# Altium schematic sheet shield.SchDoc
size B; PageSetup: Record=PageOptions|CenterHorizontal=True|CenterVertical=True|PrintScale=0.72|XCorrection=1.00|YCorrection=1.00|PrintKind=0|BorderSize=5000000|LeftOffset=0|BottomOffset=0|Orientation=2|PaperLength=1000|PaperWidth=1000|Scale=100|PaperSource=7|PrintQuality=-3|MediaType=1|DitherType=10|PrintScaleMode=1|PaperKind=Letter|PaperIndex=1
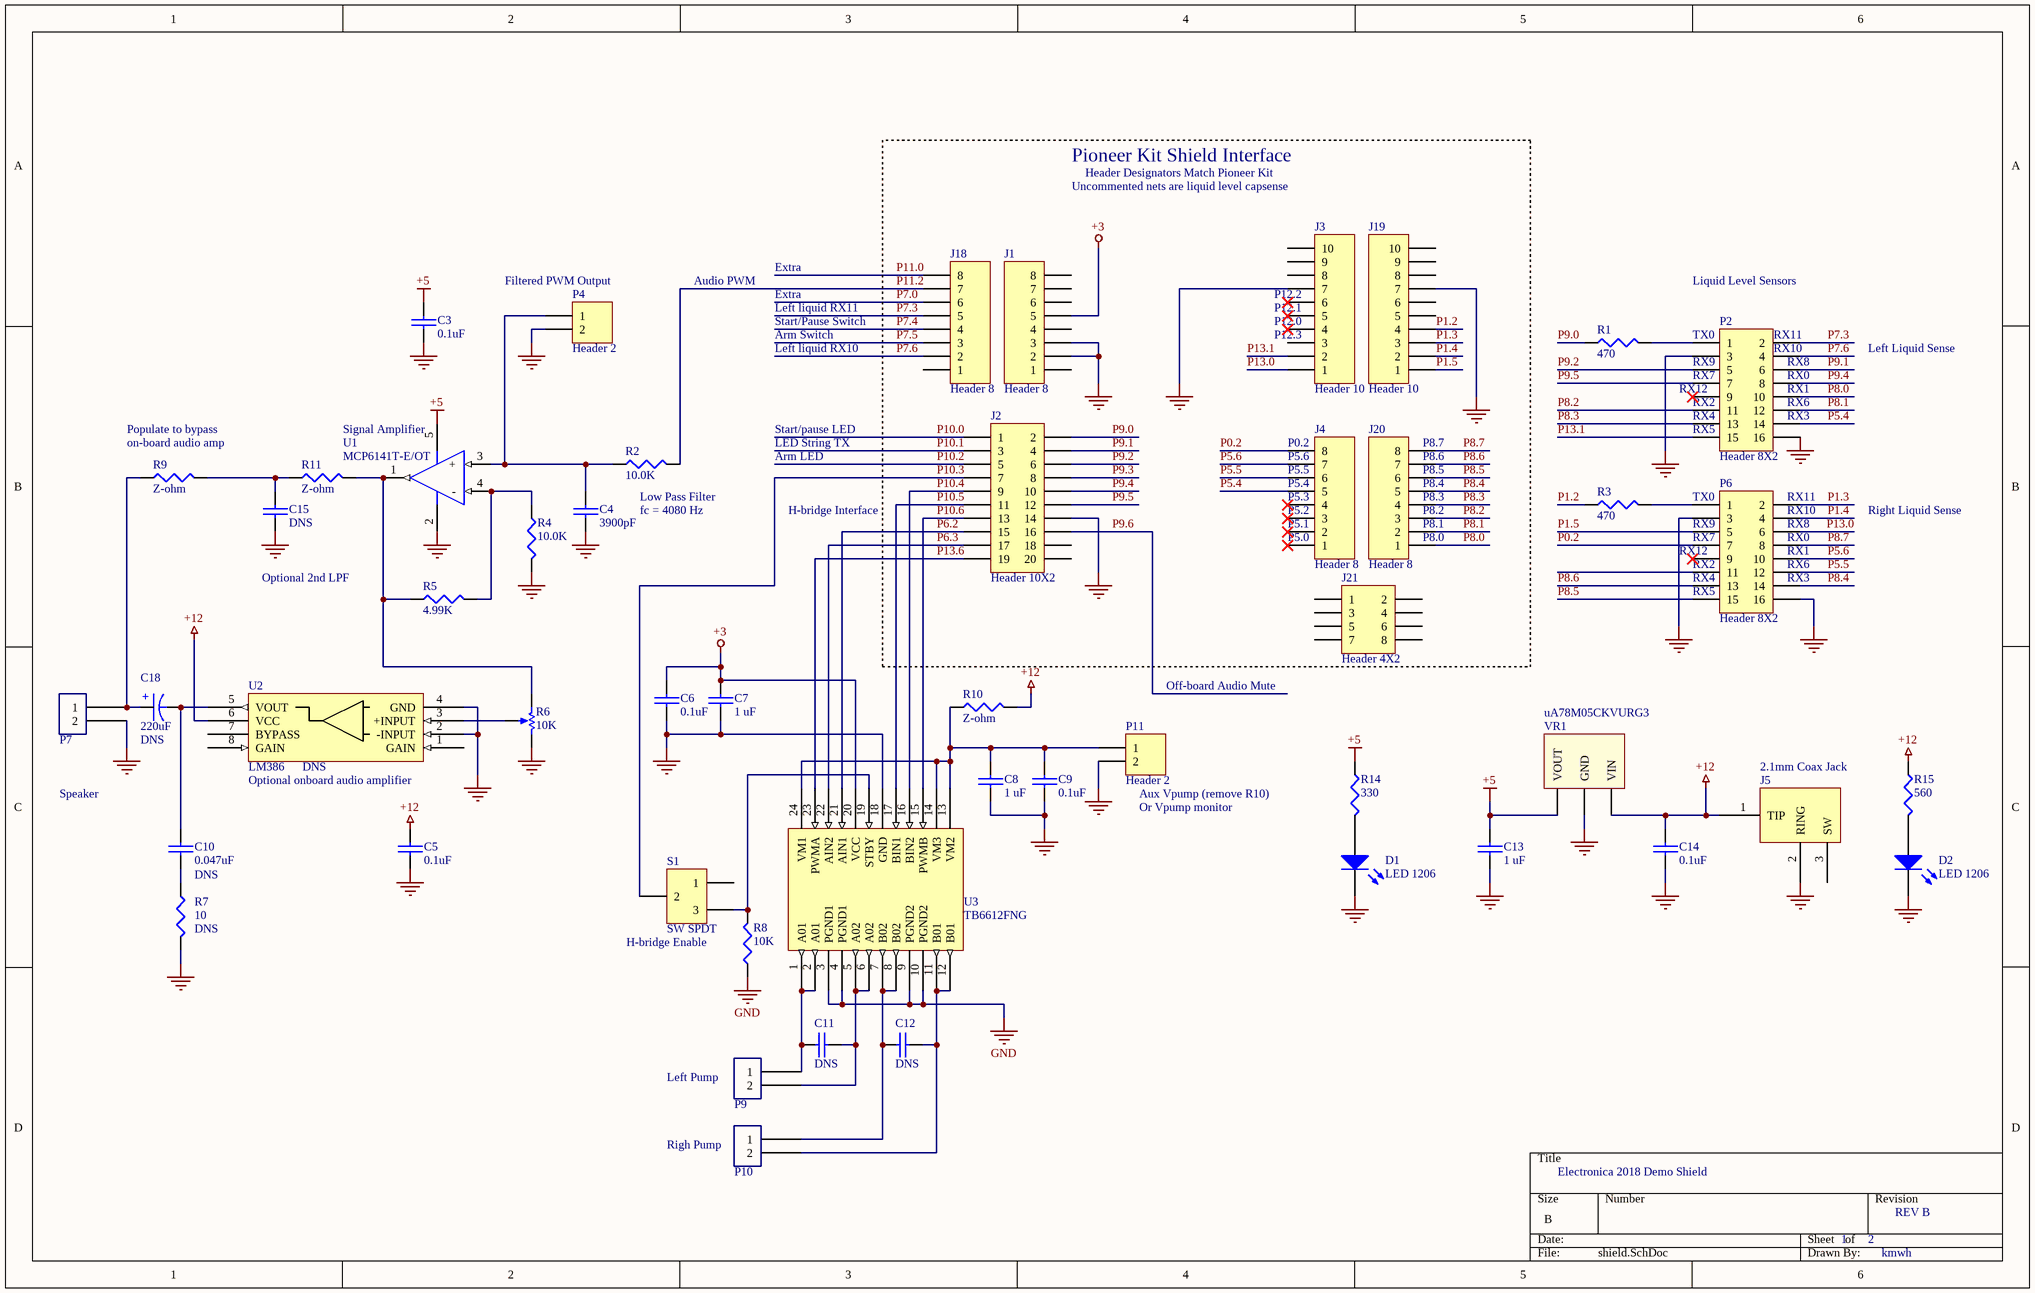
[diagram p0: shield.SchDoc]

## Parts
C3  0.1uF  [C0603]
C4  3900pF  [C0603]
C5  0.1uF  [C0603]
C6  0.1uF  [C0603]
C7  1 uF  [C0805]
C8  1 uF  [C0805]
C9  0.1uF  [C0603]
C10  0.047uF  [C0603]
C11  DNS  [C0805]
C12  DNS  [C0805]
C13  1 uF  [C0805]
C14  0.1uF  [C0603]
C15  DNS  [C0603]
C18  value 220uF  [RadCap.98]  (hidden comment: 11-000010-ARD)
D1  LED 1206  [3216[1206]]
D2  LED 1206  [3216[1206]]
J1  Header 8  [HDR1X8]
J2  Header 10X2  [HDR2X10]
J3  Header 10  [HDR1X10]
J4  Header 8  [HDR1X8]
J5  2.1mm Coax Jack  [COAX_JACK_ALL]
J18  Header 8  [HDR1X8]
J19  Header 10  [HDR1X10]
J20  Header 8  [HDR1X8]
J21  Header 4X2  [HDR2X4]
P2  Header 8X2  [HDR2X8]
P4  Header 2  [HDR1X2]
P6  Header 8X2  [HDR2X8]
P7  Connector, 0.138", 2  [connector-0.138-2pin]  (value not drawn)
P9  Connector, 0.138", 2  [connector-0.138-2pin]  (value not drawn)
P10  Connector, 0.138", 2  [connector-0.138-2pin]  (value not drawn)
P11  Header 2  [HDR1X2]
R1  470  [R0603]
R2  10.0K  [R0603]
R3  470  [R0603]
R4  10.0K  [R0603]
R5  4.99K  [R0603]
R6  value 10K  [TrimmerPot]  (hidden comment: RPot)
R7  10  [R0603]
R8  10K  [R0603]
R9  Z-ohm  [R0603]
R10  Z-ohm  [R0603]
R11  Z-ohm  [R0603]
R14  330  [R0603]
R15  560  [R0603]
S1  SW SPDT  [HDR1X3]
U1  MCP6141T-E/OT  [SOT23-5]
U2  LM386  [SO8]
U3  TB6612FNG  [SSOP-24]
VR1  uA78M05CKVURG3  [TO-252-AB(Dpak)]

## Blocks framed on the sheet
Pioneer Kit Shield Interface: J1-J4 J18-J21

## Nets
+3: C6.1(A) C7.1(A) J1.5 U3.20(VCC)
+5: C3.1(A) C13.1(A) R14.1(A) U1.5(VCC) VR1.3(VOUT)
+12: C5.1(A) C14.1(A) J5.1(TIP) R10.2(B) R15.1(A) U2.6(VCC) VR1.1(VIN)
GND: C3.2(B) C4.2(B) C5.2(B) C6.2(B) C7.2(B) C8.2(B) C9.2(B) C13.2(B) C14.2(B) C15.2(B) D1.2(K) D2.2(K) J1.2 J1.3 J2.14 J3.7 J5.2(RING) J19.7 P2.3 P2.16 P4.2 P6.3 P6.16 P7.2 P11.2 R4.2(B) R6.1(TOP) R7.2(B) R8.1(A) U1.2(GND) U2.2(-INPUT) U2.4(GND) U3.3(PGND1) U3.4(PGND1) U3.9(PGND2) U3.10(PGND2) U3.18(GND) VR1.4(GND)
P0.2: J4.8 P6.7
P1.2: J19.4 R3.1(A)
P1.3: J19.3 P6.2
P1.4: J19.2 P6.4
P1.5: J19.1 P6.5
P5.4: J4.5 P2.14
P5.5: J4.6 P6.12
P5.6: J4.7 P6.10
P6.2: J2.15 U3.21(AIN1)
P6.3: J2.17 U3.22(AIN2)
P7.0: J18.6
P7.3: J18.5 P2.2
P7.4: J18.4
P7.5: J18.3
P7.6: J18.2 P2.4
P8.0: J20.1 P2.10
P8.1: J20.2 P2.12
P8.2: J20.3 P2.11
P8.3: J20.4 P2.13
P8.4: J20.5 P6.14
P8.5: J20.6 P6.15
P8.6: J20.7 P6.13
P8.7: J20.8 P6.8
P9.0: J2.2 R1.1(A)
P9.1: J2.4 P2.6
P9.2: J2.6 P2.5
P9.3: J2.8
P9.4: J2.10 P2.8
P9.5: J2.12 P2.7
P9.6: J2.16
P10.0: J2.1
P10.1: J2.3
P10.2: J2.5
P10.3: J2.7 S1.2
P10.4: J2.9 U3.16(BIN2)
P10.5: J2.11 U3.17(BIN1)
P10.6: J2.13 U3.15(PWMB)
P11.0: J18.8
P11.2: J18.7 R2.2(B)
P13.0: J3.1 P6.6
P13.1: J3.2 P2.15
P13.6: J2.19 U3.23(PWMA)
NetC4_1: C4.1(A) P4.1 R2.1(A) U1.3(+)
NetC8_1: C8.1(A) C9.1(A) P11.1 R10.1(A) U3.13(VM2) U3.14(VM3) U3.24(VM1)
NetC10_1: C10.1(A) C18.2(NEGATIVE) U2.5(VOUT)
NetC10_2: C10.2(B) R7.1(A)
NetC11_1: C11.1(A) P9.1 U3.1(A01) U3.2(A01)
NetC11_2: C11.2(B) P9.2 U3.5(A02) U3.6(A02)
NetC12_1: C12.1(A) P10.1 U3.7(B02) U3.8(B02)
NetC12_2: C12.2(B) P10.2 U3.11(B01) U3.12(B01)
NetC15_1: C15.1(A) R9.2(B) R11.1(A)
NetC18_1: C18.1(POSITIVE) P7.1 R9.1(A)
NetD1_1: D1.1(A) R14.2(B)
NetD2_1: D2.1(A) R15.2(B)
NetP2_1: P2.1 R1.2(B)
NetP6_1: P6.1 R3.2(B)
NetR4_1: R4.1(A) R5.2(B) U1.4(-)
NetR5_1: R5.1(A) R6.3(BOT) R11.2(B) U1.1(OUT)
NetR6_2: R6.2(TAP) U2.3(+INPUT)
NetR8_2: R8.2(B) S1.3 U3.19(STBY)

Not connected (* = marked no-connect by the designer): J1 1 4 6 7 8; J2 18 20; J3 3 4* 5* 6* 8 9 10; J4 1* 2* 3* 4*; J5 3(SW); J18 1; J19 5 6 8 9 10; J21 1 2 3 4 5 6 7 8; P2 9*; P6 9* 11; S1 1; U2 1(GAIN) 7(BYPASS) 8(GAIN)

## Notes on the sheet
- Uncommented nets are liquid level capsense
- Header Designators Match Pioneer Kit
- (near P4) Filtered PWM Output
- Audio PWM
- Extra
- (near J3) P12.2
- Liquid Level Sensors
- Start/Pause Switch
- Arm Switch
- Left liquid RX11
- Left liquid RX10
- (near J3) P12.0
- (near J3) P12.1
- (near J3) P12.3
- (near P2) TX0
- (near P2) RX9
- (near P2) RX10
- (near P2) RX11
- (near P2) RX8
- Left Liquid Sense
- (near R9) Populate to bypass
- (near U1) Signal Amplifier
- Start/pause LED
- (near P2) RX12
- (near P2) RX2
- (near P2) RX4
- (near P2) RX5
- (near P2) RX7
- (near P2) RX0
- (near P2) RX1
- (near P2) RX3
- (near P2) RX6
- (near R9) on-board audio amp
- (near R2) Low Pass Filter
- LED String TX
- Arm LED
- (near J4) P5.3
- (near J4) P5.4
- (near J4) P5.5
- (near J4) P5.6
- (near J4) P0.2
- (near J20) P8.3
- (near J20) P8.4
- (near J20) P8.5
- (near J20) P8.6
- (near J20) P8.7
- (near P6) TX0
- (near P6) RX11
- fc = 4080 Hz
- H-bridge Interface
- (near J4) P5.0
- (near J4) P5.1
- (near J4) P5.2
- (near J20) P8.0
- (near J20) P8.1
- (near J20) P8.2
- (near P6) RX12
- (near P6) RX2
- (near P6) RX7
- (near P6) RX9
- (near P6) RX0
- (near P6) RX1
- (near P6) RX6
- (near P6) RX8
- (near P6) RX10
- Right Liquid Sense
- Optional 2nd LPF
- (near P6) RX4
- (near P6) RX5
- (near P6) RX3
- Off-board Audio Mute
- (near C18) DNS
- (near U2) DNS
- Speaker
- (near U2) Optional onboard audio amplifier
- (near P11) Aux Vpump (remove R10)
- (near P11) Or Vpump monitor
- DNS
- (near R7) DNS
- H-bridge Enable
- (near P9) Left Pump
- (near P10) Righ Pump
- Electronica 2018 Demo Shield
- 1
- 2
- REV B
- kmwh
- (in symbol 11-000010-ARD) +

## Library data of the parts
C3 C5 C6 C9 C14 = CAP, CER, 0.1uF 0603: CAP, CER, 0.1UF, 50V, 10%, X7R, 0603; VENDOR: Digikey; VENDOR_PN: 445-5666-1-ND; VENDOR_LINK: https://www.digikey.com/product-detail/en/tdk-corporation/CGA3E2X7R1H104K080AA/445-5666-1-ND/2443706; VALUE: 0.1uF
C4 C10 C15 = CAP, CER, BLANK, 0603: CAP, CER, blankUF, 6.3v, 10%, X5R, 0603; VENDOR: Digikey
  C4: VALUE: 3900pF
  C10: VALUE: 0.047uF
  C15: VALUE: DNS
C7 C8 C11-C13 = CAP, CER, 1UF, 0805: CAP, CER, 1UF, 16v, 10%, X5R, 0805; VENDOR: Digikey
  C7 C8 C13: VALUE: 1 uF
  C11 C12: VALUE: DNS
C18 = 11-000010-ARD: CAP, 220uF, 10V, ELEC, RAD; Right: 20; Bottom: 10; ARMA_PN: 11-000010-ARD
J1 J4 J18 J20 = Header 8: Header, 8-Pin; LatestRevisionDate: 17-Jul-2002; LatestRevisionNote: Re-released for DXP Platform.; Publisher: Altium Limited
J2 = Header 10X2: Header, 10-Pin, Dual row; LatestRevisionDate: 17-Jul-2002; LatestRevisionNote: Re-released for DXP Platform.; Publisher: Altium Limited
J3 J19 = Header 10: Header, 10-Pin; LatestRevisionDate: 17-Jul-2002; LatestRevisionNote: Re-released for DXP Platform.; Publisher: Altium Limited
J5 = 2.1mm Coax Jack: VENDOR: All Electronics; VENDOR_PN: DCJ-1; VENDOR_LINK: *; VALUE: 2.1mm Coax Jack; MFG_LINK: *
J21 = Header 4X2: Header, 4-Pin, Dual row; LatestRevisionDate: 17-Jul-2002; LatestRevisionNote: Re-released for DXP Platform.; Publisher: Altium Limited
P2 P6 = Header 8X2: Header, 8-Pin, Dual row; LatestRevisionDate: 17-Jul-2002; LatestRevisionNote: Re-released for DXP Platform.; Publisher: Altium Limited
P4 P11 = Header 2: Header, 2-Pin; LatestRevisionDate: 17-Jul-2002; LatestRevisionNote: Re-released for DXP Platform.; Publisher: Altium Limited
P7 P9 P10 = Connector, 0.138", 2: Connector, 0.138", 2 pin
R1-R5 R7-R11 R14 R15 = RES, BLANK, 0603: RES, BLANK OHM, 1/10W, 1%, 0603 SMD; VENDOR: Digikey
  R1 R3: VALUE: 470
  R2 R4: VALUE: 10.0K
  R5: VALUE: 4.99K
  R7: VALUE: 10
  R8: VALUE: 10K
  R9-R11: VALUE: Z-ohm
  R14: VALUE: 330
  R15: VALUE: 560
R6 = RPot: Potentiometer; Set Position: 0.5; Published: 8-Jun-2000; Revision: July-2002: Re-released for DXP Platform.; Publisher: Altium Limited
S1 = Header 3: Header, 3-Pin; LatestRevisionDate: 17-Jul-2002; LatestRevisionNote: Re-released for DXP Platform.; Publisher: Altium Limited
U1 = MCP6141: IC OPAMP SINGLE MCP6141 SOT23-5; Desciption: IC OPAMP SNGL R-R MCP6141 SOT23-5; MFG: Microchip; MFG_PN: MCP6142-E/SN; VENDOR: DIGIKEY; VENDOR_PN: MCP6141T-E/OTCT-ND
U2 = LM386MX: VENDOR: Digikey; VENDOR_PN: LM386MX-1/NOPB; MFG: TI; MFG_PN: LM386MX-1/NOPB; VENDOR_LINK: https://www.digikey.com/product-detail/en/texas-instruments/LM386MX-1-NOPB/LM386MX-1-NOPBCT-ND/3440154; VALUE: LM386; MFG_LINK: http://www.ti.com/lit/ds/symlink/lm386.pdf
U3 = TB6612FNG: VENDOR: Digikey; VENDOR_PN: TB6612FNGC8EL; MFG: Toshiba; MFG_PN: TB6612FNG,C,8,EL; VENDOR_LINK: https://www.digikey.com/product-detail/en/toshiba-semiconductor-and-storage/TB6612FNGC8EL/TB6612FNGC8ELCT-ND/1730134; VALUE: TB6612FNG; MFG_LINK: https://toshiba.semicon-storage.com/info/docget.jsp?did=10660&prodName=TB6612FNG
D1 D2 = LED 1206: Published: 8-Jun-2000; LatestRevisionDate: 17-Jul-2002; LatestRevisionNote: Re-released for DXP Platform.; PackageVersion: Feb-2002; PackageReference: 3.2X1.6X1.1; Publisher: Altium Limited